# EAGLE design BreakoutBoard (EAGLE 6.4)
AUTHOR: Sandor Szilvasi; AUTHOREMAIL: sandor.szilvasi@vanderbilt.edu; COPYRIGHT: Copyright © 2013 Vanderbilt University, ISIS; PAGE1: Cover Page; PAGE2: General Breakout; PAGE3: Power Board Specific; REVIEWER: Benjamin Babjak; REVIEWEREMAIL: benjamin.babjak@vanderbilt.edu; REVISION: B; TITLE: Smoky

## Sheet 1 of 2
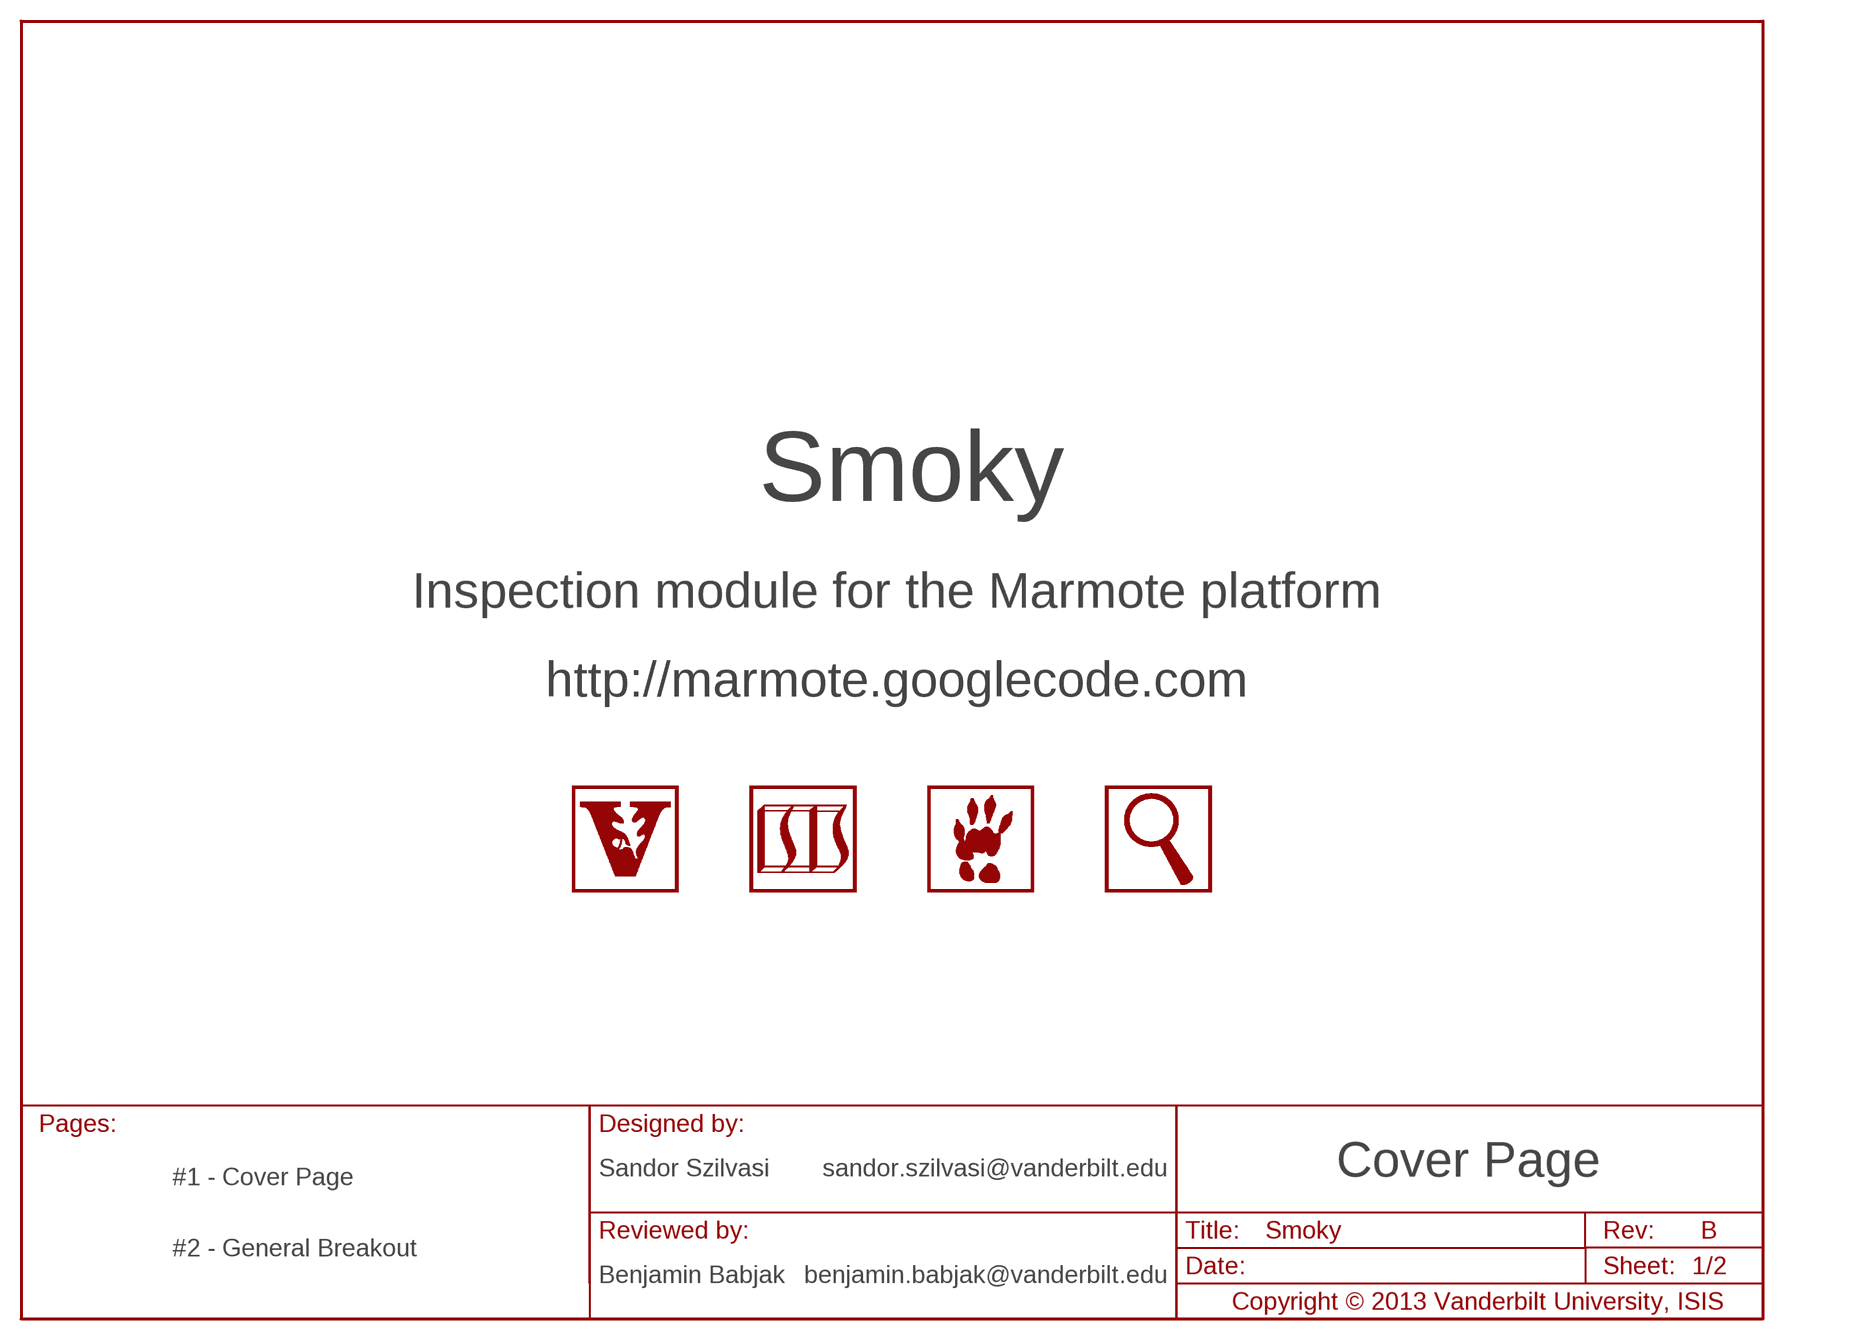
[diagram p0: schematic, sheet 1]

### Parts
LOGO1  LOGO-MAGNIFYING-GLASS-600MIL-10MM-SS  [LOGO-MAGNIFYING-GLASS-10MM-SILKSCREEN]
LOGO5  LOGO-VANDERBILT-600MIL-10MM-SS  [LOGO-VANDERBILT-10MM-SILKSCREEN]
LOGO6  LOGO-ISIS-600MIL-10MM-SS  [LOGO-ISIS-10MM-SILKSCREEN]
LOGO7  LOGO-MARMOTE-600MIL-10MM-SS  [LOGO-MARMOTE-10MM-SILKSCREEN]

### Notes on the sheet
- Inspection module for the Marmote platform
- http://marmote.googlecode.com

## Sheet 2 of 2
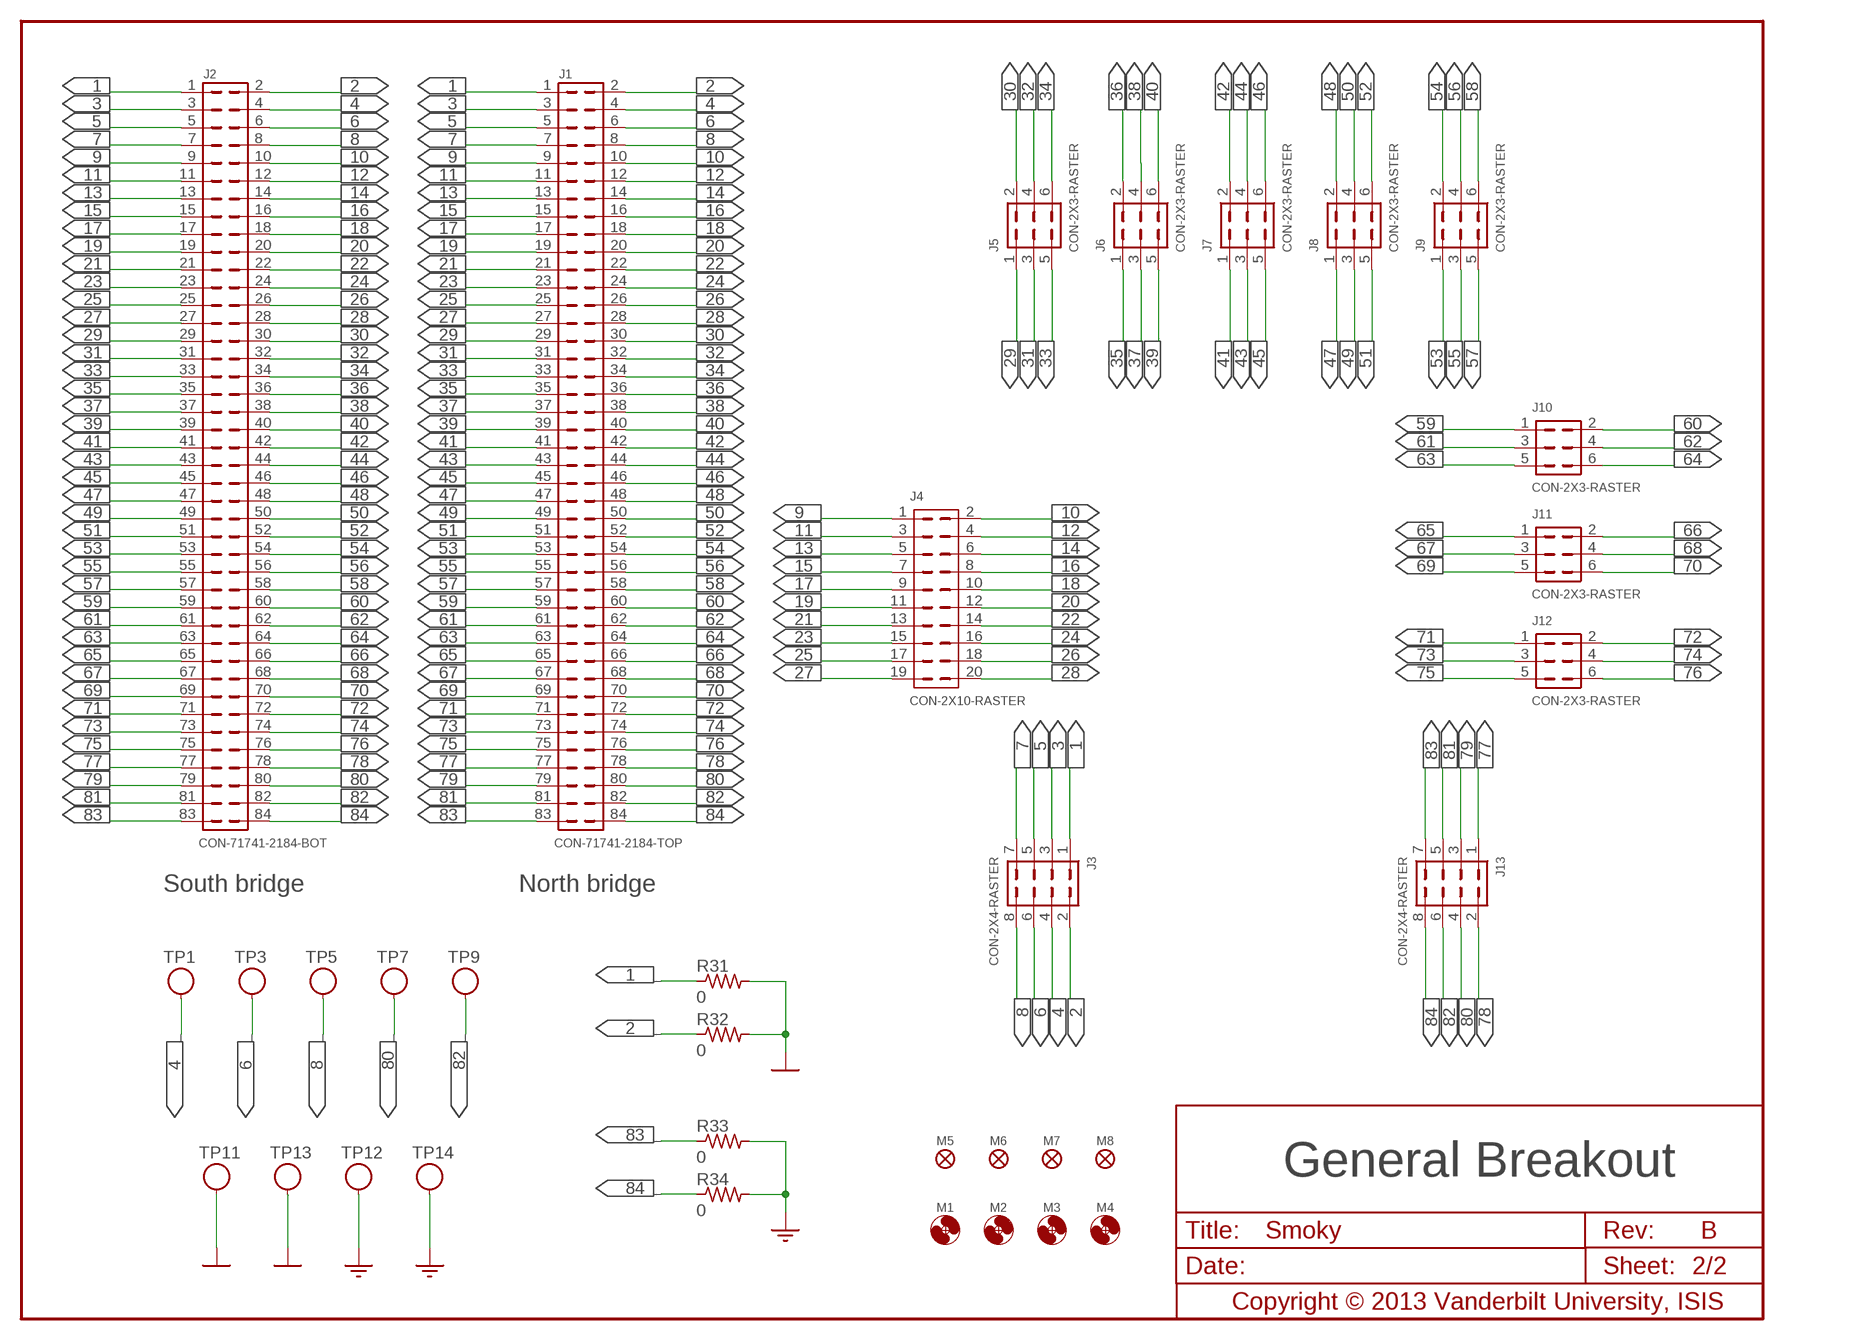
[diagram p1: schematic, sheet 2]

### Parts
J1  CON-71741-2184-TOP  [71741-0002]
J2  CON-71741-2184-BOT  [71742-3003-BOT]
J3  CON-2X4-RASTER  [2X8]
J4  CON-2X10-RASTER  [2X20]
J5  CON-2X3-RASTER  [2X6]
J6  CON-2X3-RASTER  [2X6]
J7  CON-2X3-RASTER  [2X6]
J8  CON-2X3-RASTER  [2X6]
J9  CON-2X3-RASTER  [2X6]
J10  CON-2X3-RASTER  [2X6]
J11  CON-2X3-RASTER  [2X6]
J12  CON-2X3-RASTER  [2X6]
J13  CON-2X4-RASTER  [2X8]
M1  MOUNT-HOLE3.3  [3,3]
M2  MOUNT-HOLE3.3  [3,3]
M3  MOUNT-HOLE3.3  [3,3]
M4  MOUNT-HOLE3.3  [3,3]
M5  FIDUCIAL1X2  [FIDUCIAL-1X2]
M6  FIDUCIAL1X2  [FIDUCIAL-1X2]
M7  FIDUCIAL1X2  [FIDUCIAL-1X2]
M8  FIDUCIAL1X2  [FIDUCIAL-1X2]
R31  0  R0805  [R0805]
R32  0  R0805  [R0805]
R33  0  R0805  [R0805]
R34  0  R0805  [R0805]
TP1  TESTPOINT-BLUE  [TESTPOINT]
TP3  TESTPOINT-BLUE  [TESTPOINT]
TP5  TESTPOINT-BLUE  [TESTPOINT]
TP7  TESTPOINT-GREEN  [TESTPOINT]
TP9  TESTPOINT-GREEN  [TESTPOINT]
TP11  TESTPOINT-YELLOW  [TESTPOINT]
TP12  TESTPOINT-YELLOW  [TESTPOINT]
TP13  TESTPOINT-YELLOW  [TESTPOINT]
TP14  TESTPOINT-YELLOW  [TESTPOINT]

### Nets
1: J1.1 J2.1 J3.1 R31.1
2: J1.2 J2.2 J3.2 R32.1
3: J1.3 J2.3 J3.3
4: J1.4 J2.4 J3.4 TP1.1
5: J1.5 J2.5 J3.5
6: J1.6 J2.6 J3.6 TP3.1
7: J1.7 J2.7 J3.7
8: J1.8 J2.8 J3.8 TP5.1
9: J1.9 J2.9 J4.1
10: J1.10 J2.10 J4.2
11: J1.11 J2.11 J4.3
12: J1.12 J2.12 J4.4
13: J1.13 J2.13 J4.5
14: J1.14 J2.14 J4.6
15: J1.15 J2.15 J4.7
16: J1.16 J2.16 J4.8
17: J1.17 J2.17 J4.9
18: J1.18 J2.18 J4.10
19: J1.19 J2.19 J4.11
20: J1.20 J2.20 J4.12
21: J1.21 J2.21 J4.13
22: J1.22 J2.22 J4.14
23: J1.23 J2.23 J4.15
24: J1.24 J2.24 J4.16
25: J1.25 J2.25 J4.17
26: J1.26 J2.26 J4.18
27: J1.27 J2.27 J4.19
28: J1.28 J2.28 J4.20
29: J1.29 J2.29 J5.1
30: J1.30 J2.30 J5.2
31: J1.31 J2.31 J5.3
32: J1.32 J2.32 J5.4
33: J1.33 J2.33 J5.5
34: J1.34 J2.34 J5.6
35: J1.35 J2.35 J6.1
36: J1.36 J2.36 J6.2
37: J1.37 J2.37 J6.3
38: J1.38 J2.38 J6.4
39: J1.39 J2.39 J6.5
40: J1.40 J2.40 J6.6
41: J1.41 J2.41 J7.1
42: J1.42 J2.42 J7.2
43: J1.43 J2.43 J7.3
44: J1.44 J2.44 J7.4
45: J1.45 J2.45 J7.5
46: J1.46 J2.46 J7.6
47: J1.47 J2.47 J8.1
48: J1.48 J2.48 J8.2
49: J1.49 J2.49 J8.3
50: J1.50 J2.50 J8.4
51: J1.51 J2.51 J8.5
52: J1.52 J2.52 J8.6
53: J1.53 J2.53 J9.1
54: J1.54 J2.54 J9.2
55: J1.55 J2.55 J9.3
56: J1.56 J2.56 J9.4
57: J1.57 J2.57 J9.5
58: J1.58 J2.58 J9.6
59: J1.59 J2.59 J10.1
60: J1.60 J2.60 J10.2
61: J1.61 J2.61 J10.3
62: J1.62 J2.62 J10.4
63: J1.63 J2.63 J10.5
64: J1.64 J2.64 J10.6
65: J1.65 J2.65 J11.1
66: J1.66 J2.66 J11.2
67: J1.67 J2.67 J11.3
68: J1.68 J2.68 J11.4
69: J1.69 J2.69 J11.5
70: J1.70 J2.70 J11.6
71: J1.71 J2.71 J12.1
72: J1.72 J2.72 J12.2
73: J1.73 J2.73 J12.3
74: J1.74 J2.74 J12.4
75: J1.75 J2.75 J12.5
76: J1.76 J2.76 J12.6
77: J1.77 J2.77 J13.1
78: J1.78 J2.78 J13.2
79: J1.79 J2.79 J13.3
80: J1.80 J2.80 J13.4 TP7.1
81: J1.81 J2.81 J13.5
82: J1.82 J2.82 J13.6 TP9.1
83: J1.83 J2.83 J13.7 R33.1
84: J1.84 J2.84 J13.8 R34.1
AGND: R33.2 R34.2 TP12.1 TP14.1
DGND: R31.2 R32.2 TP11.1 TP13.1

### Notes on the sheet
- South bridge | North bridge

## Library data of the parts
J1 = BreakoutBoard:CON-71741: Board-to-Board Connector 1.00mm (.039") Pitch Mezzanine Plug, Surface Mount, Dual Row, Vertical Stacking, 84 Circuits, 8.35mm (.329") Unmated Height, with PCB Locator Pegs, with Robotic Placement Metal Cap, 0.25µm (10µ") Gold (Au) Selective Plating, Embossed Tape on R Source: http://www.molex.com/molex/products/datasheet.jsp?part=active/0717410002_PCB_HEADERS.xml; DIGI-KEY#: WM3498CT-ND; MF: Molex; MPN: 71741-0002
J2 = BreakoutBoard:CON-71741: Board-to-Board Connector 1.00mm (.039") Pitch Mezzanine Plug, Surface Mount, Dual Row, Vertical Stacking, 84 Circuits, 8.35mm (.329") Unmated Height, with PCB Locator Pegs, with Robotic Placement Metal Cap, 0.25µm (10µ") Gold (Au) Selective Plating, Embossed Tape on R Source: http://www.molex.com/molex/products/datasheet.jsp?part=active/0717410002_PCB_HEADERS.xml; DIGI-KEY#: WM3499CT-ND; MF: Molex; MPN: 71742-3003
J3 J13 = BreakoutBoard:CON-2X4-RASTER
J4 = BreakoutBoard:CON-2X10-RASTER
J5-J12 = BreakoutBoard:CON-2X3-RASTER
LOGO1 = Logo:LOGO-MAGNIFYING-GLASS-600MIL: Magnifying Glass Logo Logo for the breakout board of the Marmote platform. Generated from 360 x 360 px bitmap and scaled to 600 x 600 mil. v1.0 Initial design
LOGO5 = Logo:LOGO-VANDERBILT-600MIL: Vanderbilt Logo Official Framed Vanderbilt Logo Generated from 360 x 360 px bitmap and scaled to 600 x 600 mil v1.1 Source bitmap smoothened v1.0 Initial design
LOGO6 = Logo:LOGO-ISIS-600MIL: ISIS Logo Official logo of the Institute for Software Integrated Systems (ISIS), Vanderbilt as of 2011 Generated from 360 x 360 px bitmap and scaled to 600 x 600 mil v1.0 Initial design
LOGO7 = Logo:LOGO-MARMOTE-600MIL: Marmote Platform Logo Preliminary logo for the Marmote Platform (http://marmote.googlecode.com) Generated from 360 x 360 px bitmap and scaled to 600 x 600 mil v1.1 Source bitmap smoothened v1.0 Initial design
M1-M4 = powerboard:MOUNT-HOLE: MOUNTING HOLE with drill center marker
M5-M8 = powerboard:FIDUCIAL: Fiducial Alignment Points Various fiducial points for machine vision alignment.
R31-R34 = BreakoutBoard:R: RESISTOR
TP1 TP3 TP5 = BreakoutBoard:TESTPOINT: Test Point Keystone compact through hole mount test point for SUPPLY and GROUND signals Terminal: .015 (.38) × .032 (.81) thick Phosphor Bronze Wire, Silver Plate Base: Nylon 46, UL Rated 94V-0 Mtg. Hole: .063 (1.6) Diameter Source: http://www.keyelco.com/pdfs/M55p51.pdf; DIGI-KEY#: 5122K-ND; MF: Keystone; MPN: 5122
TP7 TP9 = BreakoutBoard:TESTPOINT: Test Point Keystone compact through hole mount test point for SUPPLY and GROUND signals Terminal: .015 (.38) × .032 (.81) thick Phosphor Bronze Wire, Silver Plate Base: Nylon 46, UL Rated 94V-0 Mtg. Hole: .063 (1.6) Diameter Source: http://www.keyelco.com/pdfs/M55p51.pdf; DIGI-KEY#: 5121K-ND; MF: Keystone; MPN: 5121
TP11-TP14 = BreakoutBoard:TESTPOINT: Test Point Keystone compact through hole mount test point for SUPPLY and GROUND signals Terminal: .015 (.38) × .032 (.81) thick Phosphor Bronze Wire, Silver Plate Base: Nylon 46, UL Rated 94V-0 Mtg. Hole: .063 (1.6) Diameter Source: http://www.keyelco.com/pdfs/M55p51.pdf; DIGI-KEY#: 5009K-ND; MF: Keystone; MPN: 5009

## Board
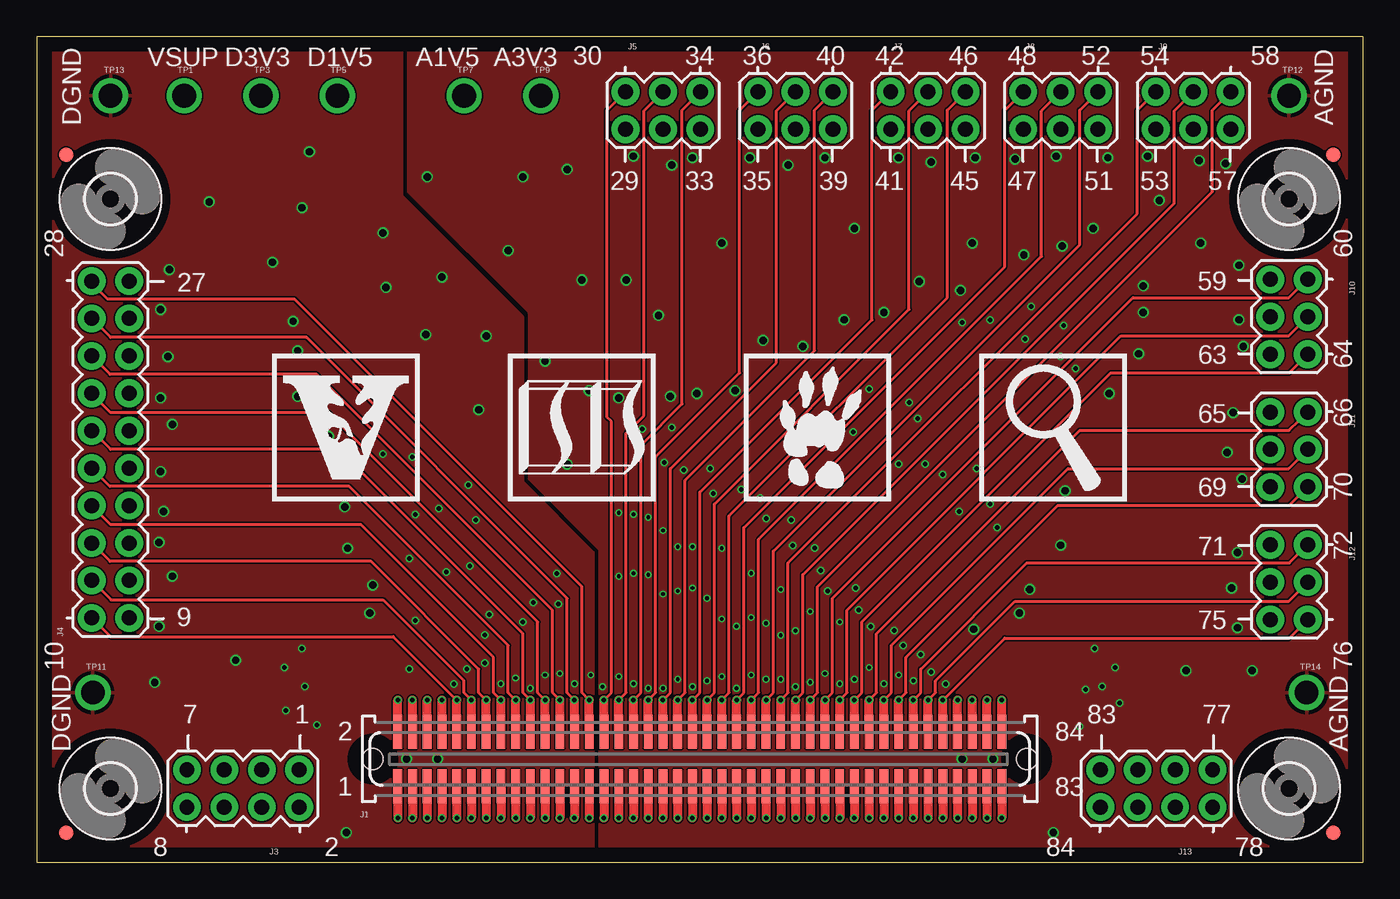
[diagram p2: board, top side]
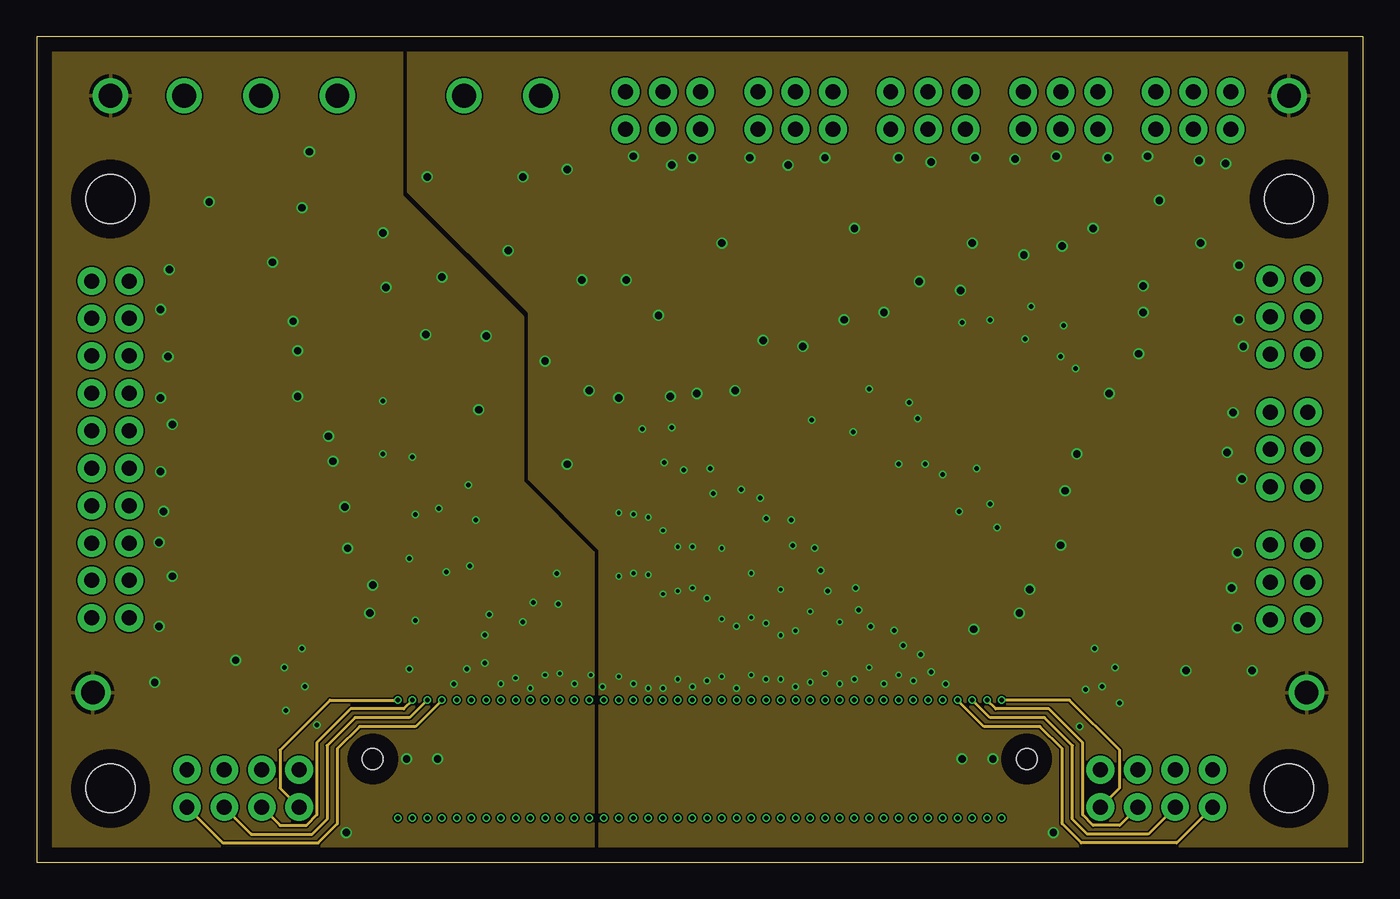
[diagram p3: board, inner layer GND]
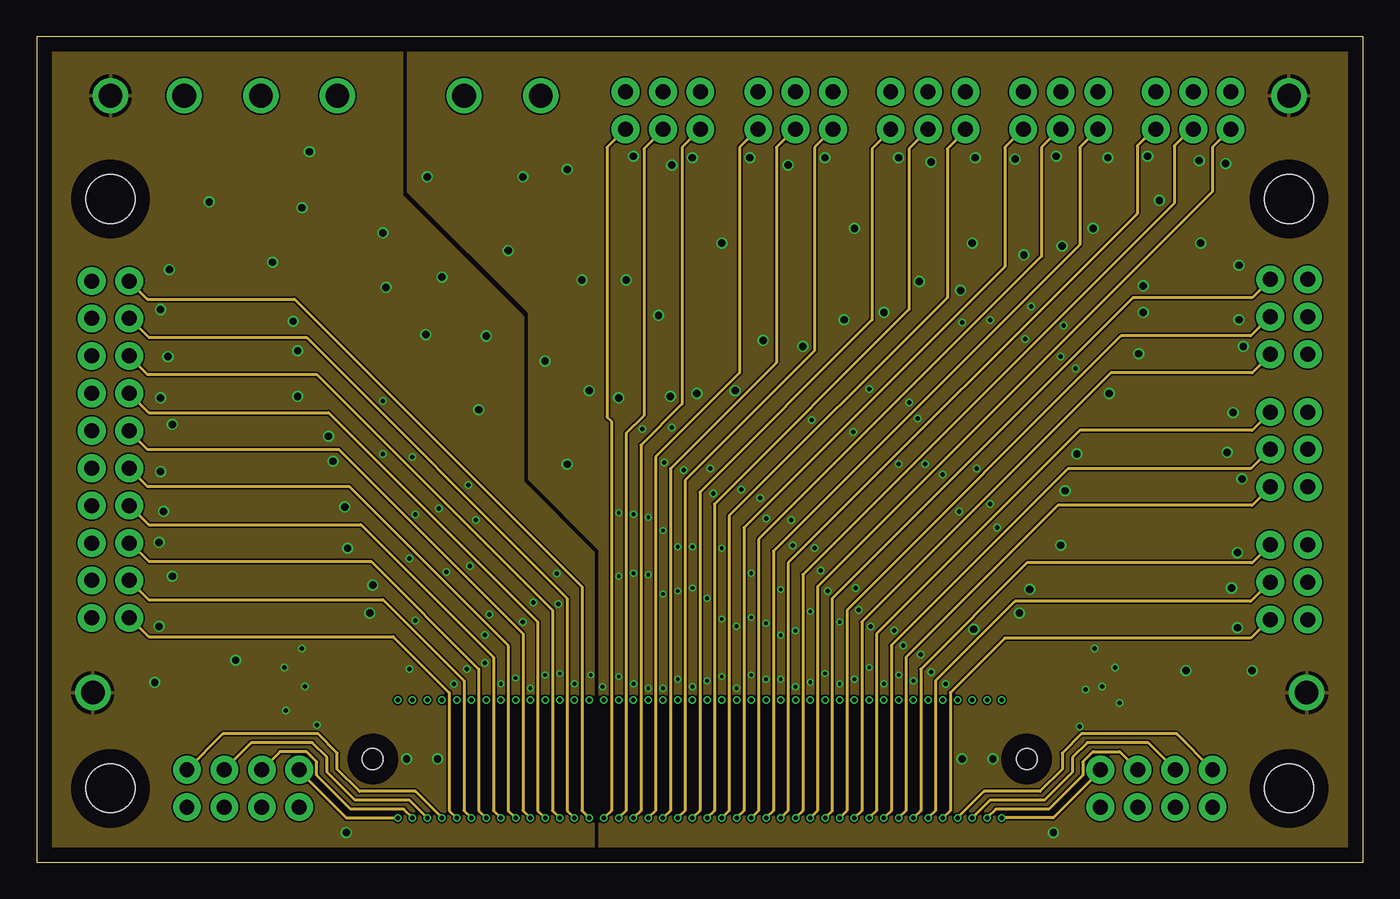
[diagram p4: board, inner layer SIGNAL]
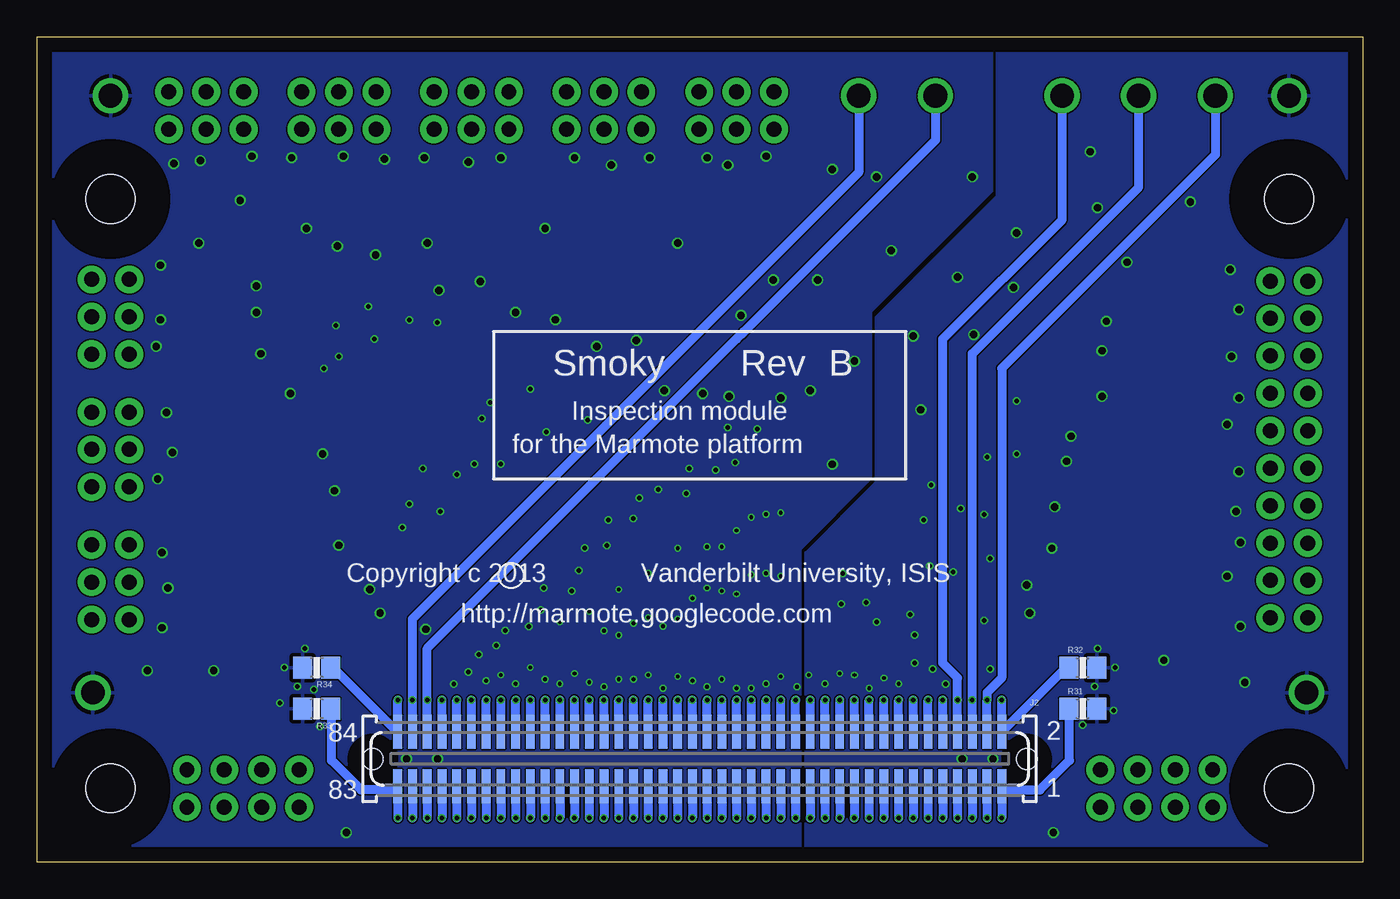
[diagram p5: board, bottom side, seen from below]

Size 90 x 56 mm. Coordinates in mm from the lower left corner, seen from the top.
Outline: 0,56 0,0 90,0 90,56 0,56
Copper layers (1*2+3*16): Top 0.0356mm / dielectric 5mil / GND 0.0356mm / dielectric 5mil / SIGNAL 0.0356mm / dielectric 40mil / Bottom 0.0356mm
Design rules "default": minimum track width 4mil, minimum drill 8mil, track to track 4mil, track to pad 4mil, pad to pad 4mil, via to via 4mil, smd to smd 4mil, copper to edge 40mil, drill to drill 8mil, minimum pad ring 10mil, minimum via ring 4mil, stop-mask expansion 2mil, vias tented up to drill 0.5mm, thermal gap 10mil

### Footprints (pad centres in the part's own frame; a part is rotated, then mirrored left to right if it is on the bottom)
71741-0002 = smd 0.6 x 2.3: 1 -20.5,-1.85; 2 -20.5,1.85; 3 -19.5,-1.85; 4 -19.5,1.85; 5 -18.5,-1.85; 6 -18.5,1.85; 7 -17.5,-1.85; 8 -17.5,1.85; 9 -16.5,-1.85; 10 -16.5,1.85; 11 -15.5,-1.85; 12 -15.5,1.85; 13 -14.5,-1.85; 14 -14.5,1.85; 15 -13.5,-1.85; 16 -13.5,1.85; 17 -12.5,-1.85; 18 -12.5,1.85; 19 -11.5,-1.85; 20 -11.5,1.85; 21 -10.5,-1.85; 22 -10.5,1.85; 23 -9.5,-1.85; 24 -9.5,1.85; 25 -8.5,-1.85; 26 -8.5,1.85; 27 -7.5,-1.85; 28 -7.5,1.85; 29 -6.5,-1.85; 30 -6.5,1.85; 31 -5.5,-1.85; 32 -5.5,1.85; 33 -4.5,-1.85; 34 -4.5,1.85; 35 -3.5,-1.85; 36 -3.5,1.85; 37 -2.5,-1.85; 38 -2.5,1.85; 39 -1.5,-1.85; 40 -1.5,1.85; 41 -0.5,-1.85; 42 -0.5,1.85; 43 0.5,-1.85; 44 0.5,1.85; 45 1.5,-1.85; 46 1.5,1.85; 47 2.5,-1.85; 48 2.5,1.85; 49 3.5,-1.85; 50 3.5,1.85; 51 4.5,-1.85; 52 4.5,1.85; 53 5.5,-1.85; 54 5.5,1.85; 55 6.5,-1.85; 56 6.5,1.85; 57 7.5,-1.85; 58 7.5,1.85; 59 8.5,-1.85; 60 8.5,1.85; 61 9.5,-1.85; 62 9.5,1.85; 63 10.5,-1.85; 64 10.5,1.85; 65 11.5,-1.85; 66 11.5,1.85; 67 12.5,-1.85; 68 12.5,1.85; 69 13.5,-1.85; 70 13.5,1.85; 71 14.5,-1.85; 72 14.5,1.85; 73 15.5,-1.85; 74 15.5,1.85; 75 16.5,-1.85; 76 16.5,1.85; 77 17.5,-1.85; 78 17.5,1.85; 79 18.5,-1.85; 80 18.5,1.85; 81 19.5,-1.85; 82 19.5,1.85; 83 20.5,-1.85; 84 20.5,1.85 | hole 1.4: -22.2,0; 22.2,0
71742-3003-BOT = smd 0.6 x 2.3: 1 -20.5,1.85; 2 -20.5,-1.85; 3 -19.5,1.85; 4 -19.5,-1.85; 5 -18.5,1.85; 6 -18.5,-1.85; 7 -17.5,1.85; 8 -17.5,-1.85; 9 -16.5,1.85; 10 -16.5,-1.85; 11 -15.5,1.85; 12 -15.5,-1.85; 13 -14.5,1.85; 14 -14.5,-1.85; 15 -13.5,1.85; 16 -13.5,-1.85; 17 -12.5,1.85; 18 -12.5,-1.85; 19 -11.5,1.85; 20 -11.5,-1.85; 21 -10.5,1.85; 22 -10.5,-1.85; 23 -9.5,1.85; 24 -9.5,-1.85; 25 -8.5,1.85; 26 -8.5,-1.85; 27 -7.5,1.85; 28 -7.5,-1.85; 29 -6.5,1.85; 30 -6.5,-1.85; 31 -5.5,1.85; 32 -5.5,-1.85; 33 -4.5,1.85; 34 -4.5,-1.85; 35 -3.5,1.85; 36 -3.5,-1.85; 37 -2.5,1.85; 38 -2.5,-1.85; 39 -1.5,1.85; 40 -1.5,-1.85; 41 -0.5,1.85; 42 -0.5,-1.85; 43 0.5,1.85; 44 0.5,-1.85; 45 1.5,1.85; 46 1.5,-1.85; 47 2.5,1.85; 48 2.5,-1.85; 49 3.5,1.85; 50 3.5,-1.85; 51 4.5,1.85; 52 4.5,-1.85; 53 5.5,1.85; 54 5.5,-1.85; 55 6.5,1.85; 56 6.5,-1.85; 57 7.5,1.85; 58 7.5,-1.85; 59 8.5,1.85; 60 8.5,-1.85; 61 9.5,1.85; 62 9.5,-1.85; 63 10.5,1.85; 64 10.5,-1.85; 65 11.5,1.85; 66 11.5,-1.85; 67 12.5,1.85; 68 12.5,-1.85; 69 13.5,1.85; 70 13.5,-1.85; 71 14.5,1.85; 72 14.5,-1.85; 73 15.5,1.85; 74 15.5,-1.85; 75 16.5,1.85; 76 16.5,-1.85; 77 17.5,1.85; 78 17.5,-1.85; 79 18.5,1.85; 80 18.5,-1.85; 81 19.5,1.85; 82 19.5,-1.85; 83 20.5,1.85; 84 20.5,-1.85 | hole 1.4: -22.2,0; 22.2,0
2X8 = drill 1.016 pad 1.88: 1 -3.81,-1.27; 2 -3.81,1.27; 3 -1.27,-1.27; 4 -1.27,1.27; 5 1.27,-1.27; 6 1.27,1.27; 7 3.81,-1.27; 8 3.81,1.27
2X20 = drill 1.016 pad 1.88: 1 -11.43,-1.27; 2 -11.43,1.27; 3 -8.89,-1.27; 4 -8.89,1.27; 5 -6.35,-1.27; 6 -6.35,1.27; 7 -3.81,-1.27; 8 -3.81,1.27; 9 -1.27,-1.27; 10 -1.27,1.27; 11 1.27,-1.27; 12 1.27,1.27; 13 3.81,-1.27; 14 3.81,1.27; 15 6.35,-1.27; 16 6.35,1.27; 17 8.89,-1.27; 18 8.89,1.27; 19 11.43,-1.27; 20 11.43,1.27
2X6 = drill 1.016 pad 1.88: 1 -2.54,-1.27; 2 -2.54,1.27; 3 0,-1.27; 4 0,1.27; 5 2.54,-1.27; 6 2.54,1.27
3,3 = hole 3.3: 0,0
FIDUCIAL-1X2 = smd 1 x 1: 1 0,0
R0805 = smd 1.3 x 1.5: 1 -0.95,0; 2 0.95,0
TESTPOINT = drill 1.6: 1 0,0

### Placement (x,y rotation side)
J1  45,7 0 top
J2  45,7 180 bottom
J3  14,5 180 top
J4  5,28 90 top
J5  42.5,51 0 top
J6  51.5,51 0 top
J7  60.5,51 0 top
J8  69.5,51 0 top
J9  78.5,51 0 top
J10  85,37 270 top
J11  85,28 270 top
J12  85,19 270 top
J13  76,5 180 top
LOGO1  64,24.5 0 top
LOGO5  16,24.5 0 top
LOGO6  32,24.5 0 top
LOGO7  48,24.5 0 top
M1  5,5 0 top
M2  5,45 0 top
M3  85,45 0 top
M4  85,5 0 top
M5  2,2 0 top
M6  2,48 0 top
M7  88,48 0 top
M8  88,2 0 top
R31  19,10.4 0 bottom
R32  19,13.2 0 bottom
R33  71,10.4 180 bottom
R34  71,13.2 180 bottom
TP1  10,52 0 top
TP3  15.2,52 0 top
TP5  20.4,52 0 top
TP7  29,52 0 top
TP9  34.2,52 0 top
TP11  3.8,11.5 0 top
TP12  85,52 0 top
TP13  5,52 0 top
TP14  86.2,11.5 0 top

### Tracks (layer width: path | path; a pad name or v marks a point on that pad's centre or on a via)
1  (via drill 0.3)
  Top 0.61: J1.1 v24.5,3
  SIGNAL 0.203: 18,6 21,3 v24.5,3
  SIGNAL 0.254: 18,6 17.81,6 J3.1
  Bottom 0.254: 19.9,9.8 19.95,9.8 R31.1 | 24.45,5.13 24.5,5.13 J1.1
  Bottom 0.406: 24.45,5.13 24.4,4.9
  Bottom 0.61: 24.4,4.9 21.9,4.9 19.9,6.9 19.9,9.8 | J1.1 v24.5,3
2  (via drill 0.3)
  Top 0.61: J1.2 v24.5,11
  GND 0.203: v24.5,11 19.9,11 16.5,7.6 16.5,5.02 J3.2
  Bottom 0.254: 20.35,13 19.95,13 R32.1
  Bottom 0.61: 20.35,13 J1.2 v24.5,11
3  (via drill 0.3)
  Top 0.61: J1.3 v25.5,3
  SIGNAL 0.203: v25.5,3 24.9,3.6 21.3,3.6 19,5.9 19,6.8 18.3,7.5 16.5,7.5 J3.3
  Bottom 0.61: J1.3 v25.5,3
4  (via drill 0.3)
  Top 0.61: J1.4 v25.5,11
  GND 0.203: v25.5,11 24.9,10.4 21.3,10.4 19,8.1 19,3.2 18.3,2.5 16.5,2.5 J3.4
  Bottom 0.61: J1.4 v25.5,11 25.5,11.5 24.5,12.5 24.5,33.5 10,48 TP1.1
5  (via drill 0.3)
  Top 0.61: J1.5 v26.5,3
  SIGNAL 0.203: v26.5,3 25.3,4.2 21.6,4.2 19.7,6.1 19.7,7.1 18.7,8.1 14.56,8.1 J3.5
  Bottom 0.61: J1.5 v26.5,3
6  (via drill 0.3)
  Top 0.61: J1.6 v26.5,11
  GND 0.203: v26.5,11 25.3,9.8 21.6,9.8 19.7,7.9 19.7,2.9 18.7,1.9 14.56,1.9 J3.6
  Bottom 0.61: J1.6 v26.5,11 26.5,34.5 15.2,45.8 TP3.1
7  (via drill 0.3)
  Top 0.61: J1.7 v27.5,3
  SIGNAL 0.203: v27.5,3 25.7,4.8 21.9,4.8 20.4,6.3 20.4,7.4 19.1,8.7 12.62,8.7 J3.7
  Bottom 0.61: J1.7 v27.5,3
8  (via drill 0.3)
  Top 0.61: J1.8 v27.5,11
  GND 0.203: v27.5,11 25.7,9.2 21.9,9.2 20.4,7.7 20.4,2.6 19.1,1.3 12.62,1.3 J3.8
  Bottom 0.61: J1.8 v27.5,11 27.5,12.5 28.5,13.5 28.5,35.5 20.4,43.6 TP5.1
9  (via drill 0.3)
  Top 0.61: J1.9 v28.5,3
  SIGNAL 0.203: v28.5,3 28,3.5 28,11.5 24.2,15.3 7.6,15.3 6.33,16.57 J4.1
  Bottom 0.61: J1.9 v28.5,3
10  (via drill 0.3)
  Top 0.203: J4.2 5,15.3 24.2,15.3 v28.5,11
  Top 0.61: J1.10 v28.5,11
  Bottom 0.61: J1.10 v28.5,11
11  (via drill 0.3)
  Top 0.61: J1.11 v29.5,3
  SIGNAL 0.203: v29.5,3 29,3.5 29,12.3 23.49,17.81 7.6,17.8 6.29,19.11 J4.3
  Bottom 0.61: J1.11 v29.5,3
12  (via drill 0.3)
  Top 0.203: J4.4 5.04,17.8 23.5,17.8 29,12.3 29,11.5 v29.5,11
  Top 0.61: J1.12 v29.5,11
  Bottom 0.61: J1.12 v29.5,11
13  (via drill 0.3)
  Top 0.61: J1.13 v30.5,3
  SIGNAL 0.203: v30.5,3 30,3.5 30,13.1 22.7,20.4 7.6,20.4 6.35,21.65 J4.5
  Bottom 0.61: J1.13 v30.5,3
14  (via drill 0.3)
  Top 0.203: J4.6 4.98,20.4 22.7,20.4 30,13.1 30,11.5 v30.5,11
  Top 0.61: J1.14 v30.5,11
  Bottom 0.61: J1.14 v30.5,11
15  (via drill 0.3)
  Top 0.61: J1.15 v31.5,3
  SIGNAL 0.203: v31.5,3 31,3.5 31,13.9 22,22.9 7.6,22.9 6.31,24.19 J4.7
  Bottom 0.61: J1.15 v31.5,3
16  (via drill 0.3)
  Top 0.203: J4.8 5.02,22.9 22,22.9 31,13.9 31,11.5 v31.5,11
  Top 0.61: J1.16 v31.5,11
  Bottom 0.61: J1.16 v31.5,11
17  (via drill 0.3)
  Top 0.61: J1.17 v32.5,3
  SIGNAL 0.203: v32.5,3 32,3.5 32,14.7 21.2,25.5 7.5,25.5 J4.9
  Bottom 0.61: J1.17 v32.5,3
18  (via drill 0.3)
  Top 0.203: J4.10 4.96,25.5 21.2,25.5 32,14.7 32,11.5 v32.5,11
  Top 0.61: J1.18 v32.5,11
  Bottom 0.61: J1.18 v32.5,11
19  (via drill 0.3)
  Top 0.61: J1.19 v33.5,3
  SIGNAL 0.203: v33.5,3 33,3.5 33,15.5 20.5,28 7.5,28 6.27,29.23 J4.11
  Bottom 0.61: J1.19 v33.5,3
20  (via drill 0.3)
  Top 0.203: J4.12 5,28 20.5,28 33,15.5 33,11.5 v33.5,11
  Top 0.61: J1.20 v33.5,11
  Bottom 0.61: J1.20 v33.5,11
21  (via drill 0.3)
  Top 0.61: J1.21 v34.5,3
  SIGNAL 0.203: v34.5,3 34,3.5 34,16.3 19.8,30.5 7.6,30.5 6.29,31.81 J4.13
  Bottom 0.61: J1.21 v34.5,3
22  (via drill 0.3)
  Top 0.203: J4.14 5,30.5 19.8,30.5 34,16.3 34,11.5 v34.5,11
  Top 0.61: J1.22 v34.5,11
  Bottom 0.61: J1.22 v34.5,11
23  (via drill 0.3)
  Top 0.61: J1.23 v35.5,3
  SIGNAL 0.203: v35.5,3 35,3.5 35,17.1 19,33.1 7.5,33.1 6.27,34.33 J4.15
  Bottom 0.61: J1.23 v35.5,3
24  (via drill 0.3)
  Top 0.203: J4.16 4.98,33.1 19,33.1 35,17.1 35,11.5 v35.5,11
  Top 0.61: J1.24 v35.5,11
  Bottom 0.61: J1.24 v35.5,11
25  (via drill 0.3)
  Top 0.61: J1.25 v36.5,3
  SIGNAL 0.203: v36.5,3 36,3.5 36,17.9 18.3,35.6 7.6,35.6 6.31,36.89 J4.17
  Bottom 0.61: J1.25 v36.5,3
26  (via drill 0.3)
  Top 0.203: J4.18 5,35.6 18.3,35.6 36,17.9 36,11.5 v36.5,11
  Top 0.61: J1.26 v36.5,11
  Bottom 0.61: J1.26 v36.5,11
27  (via drill 0.3)
  Top 0.61: J1.27 v37.5,3
  SIGNAL 0.203: v37.5,3 37,3.5 37,18.7 17.5,38.2 7.5,38.2 J4.19
  Bottom 0.61: J1.27 v37.5,3
28  (via drill 0.3)
  Top 0.203: 3.73,39.27 4.8,38.2 17.5,38.2 37,18.7 37,11.5 v37.5,11
  Top 0.254: 3.73,39.27 J4.20
  Top 0.61: J1.28 v37.5,11
  Bottom 0.61: J1.28 v37.5,11
29  (via drill 0.3)
  Top 0.61: J1.29 v38.5,3
  SIGNAL 0.203: v38.5,3 39,3.5 39,29.9 38.7,30.2 38.7,48.5 39.93,49.73 J5.1
  Bottom 0.61: J1.29 v38.5,3
30  (via drill 0.3)
  Top 0.203: J5.2 38.7,51.01 38.7,30.2 39,29.9 39,11.9 39,11.5 v38.5,11
  Top 0.61: J1.30 v38.5,11
  Bottom 0.61: J1.30 v38.5,11
31  (via drill 0.3)
  Top 0.61: J1.31 v39.5,3
  SIGNAL 0.203: v39.5,3 40,3.5 40,29.1 41.2,30.3 41.2,48.4 42.5,49.7 J5.3
  Bottom 0.61: J1.31 v39.5,3
32  (via drill 0.3)
  Top 0.203: J5.4 41.2,50.97 41.2,30.3 40,29.1 40,11.5 v39.5,11
  Top 0.61: J1.32 v39.5,11
  Bottom 0.61: J1.32 v39.5,11
33  (via drill 0.3)
  Top 0.61: J1.33 v40.5,3
  SIGNAL 0.203: v40.5,3 41,3.5 41,28.3 43.8,31.1 43.8,48.5 J5.5
  Bottom 0.61: J1.33 v40.5,3
34  (via drill 0.3)
  Top 0.203: J5.6 43.8,51.03 43.8,31.1 41,28.3 41,11.5 v40.5,11
  Top 0.61: J1.34 v40.5,11
  Bottom 0.61: J1.34 v40.5,11
35  (via drill 0.3)
  Top 0.61: J1.35 v41.5,3
  SIGNAL 0.203: v41.5,3 42,3.5 42,27.5 47.7,33.2 47.7,48.5 48.93,49.73 J6.1
  Bottom 0.61: J1.35 v41.5,3
36  (via drill 0.3)
  Top 0.203: J6.2 47.7,51.01 47.7,33.2 42,27.5 42,11.5 v41.5,11
  Top 0.61: J1.36 v41.5,11
  Bottom 0.61: J1.36 v41.5,11
37  (via drill 0.3)
  Top 0.61: J1.37 v42.5,3
  SIGNAL 0.203: v42.5,3 43,3.5 43,26.7 50.2,33.9 50.2,48.5 51.43,49.73 J6.3
  Bottom 0.61: J1.37 v42.5,3
38  (via drill 0.3)
  Top 0.203: J6.4 50.2,50.97 50.2,33.9 43,26.7 43,11.5 v42.5,11
  Top 0.61: J1.38 v42.5,11
  Bottom 0.61: J1.38 v42.5,11
39  (via drill 0.3)
  Top 0.61: J1.39 v43.5,3
  SIGNAL 0.203: v43.5,3 44,3.5 44,25.9 52.8,34.7 52.8,48.5 J6.5
  Bottom 0.61: J1.39 v43.5,3
40  (via drill 0.3)
  Top 0.203: J6.6 52.8,51.03 52.8,34.7 44,25.9 44,11.5 v43.5,11
  Top 0.61: J1.40 v43.5,11
  Bottom 0.61: J1.40 v43.5,11
41  (via drill 0.3)
  Top 0.61: J1.41 v44.5,3
  SIGNAL 0.203: v44.5,3 45,3.5 45,25.1 56.7,36.8 56.7,48.4 57.96,49.66 J7.1
  Bottom 0.61: J1.41 v44.5,3
42  (via drill 0.3)
  Top 0.203: J7.2 56.7,51.01 56.7,36.8 45,25.1 45,11.5 v44.5,11
  Top 0.61: J1.42 v44.5,11
  Bottom 0.61: J1.42 v44.5,11
43  (via drill 0.3)
  Top 0.61: J1.43 v45.5,3
  SIGNAL 0.203: v45.5,3 46,3.5 46,24.3 59.2,37.5 59.2,48.4 60.5,49.7 J7.3
  Bottom 0.61: J1.43 v45.5,3
44  (via drill 0.3)
  Top 0.203: J7.4 59.2,50.97 59.2,37.5 46,24.3 46,11.5 v45.5,11
  Top 0.61: J1.44 v45.5,11
  Bottom 0.61: J1.44 v45.5,11
45  (via drill 0.3)
  Top 0.61: J1.45 v46.5,3
  SIGNAL 0.203: v46.5,3 47,3.5 47,23.5 61.8,38.3 61.8,48.4 63.04,49.64 J7.5
  Bottom 0.61: J1.45 v46.5,3
46  (via drill 0.3)
  Top 0.203: J7.6 61.8,51.03 61.8,38.3 47,23.5 47,11.5 v46.5,11
  Top 0.61: J1.46 v46.5,11
  Bottom 0.61: J1.46 v46.5,11
47  (via drill 0.3)
  Top 0.61: J1.47 v47.5,3
  SIGNAL 0.203: v47.5,3 48,3.5 48,22.7 65.7,40.4 65.7,48.5 66.93,49.73 J8.1
  Bottom 0.61: J1.47 v47.5,3
48  (via drill 0.3)
  Top 0.203: J8.2 65.7,51.01 65.7,40.4 48,22.7 48,11.5 v47.5,11
  Top 0.61: J1.48 v47.5,11
  Bottom 0.61: J1.48 v47.5,11
49  (via drill 0.3)
  Top 0.61: J1.49 v48.5,3
  SIGNAL 0.203: v48.5,3 49,3.5 49,21.9 68.2,41.1 68.2,48.5 69.43,49.73 J8.3
  Bottom 0.61: J1.49 v48.5,3
50  (via drill 0.3)
  Top 0.203: J8.4 68.2,50.97 68.2,41.1 49,21.9 49,11.5 v48.5,11
  Top 0.61: J1.50 v48.5,11
  Bottom 0.61: J1.50 v48.5,11
51  (via drill 0.3)
  Top 0.61: J1.51 v49.5,3
  SIGNAL 0.203: v49.5,3 50,3.5 50,21.1 70.8,41.9 70.8,48.5 J8.5
  Bottom 0.61: J1.51 v49.5,3
52  (via drill 0.3)
  Top 0.203: J8.6 70.8,51.03 70.8,41.9 50,21.1 50,11.5 v49.5,11
  Top 0.61: J1.52 v49.5,11
  Bottom 0.61: J1.52 v49.5,11
53  (via drill 0.3)
  Top 0.61: J1.53 v50.5,3
  SIGNAL 0.203: v50.5,3 51,3.5 51,20.3 74.7,44 74.7,48.6 75.83,49.73 J9.1
  Bottom 0.61: J1.53 v50.5,3
54  (via drill 0.3)
  Top 0.203: J9.2 74.7,51.01 74.7,44 51,20.3 51,11.5 v50.5,11
  Top 0.61: J1.54 v50.5,11
  Bottom 0.61: J1.54 v50.5,11
55  (via drill 0.3)
  Top 0.61: J1.55 v51.5,3
  SIGNAL 0.203: v51.5,3 52,3.5 52,19.5 77.2,44.7 77.2,48.6 78.33,49.73 J9.3
  Bottom 0.61: J1.55 v51.5,3
56  (via drill 0.3)
  Top 0.203: J9.4 77.2,50.97 77.2,44.7 52,19.5 52,11.5 v51.5,11
  Top 0.61: J1.56 v51.5,11
  Bottom 0.61: J1.56 v51.5,11
57  (via drill 0.3)
  Top 0.61: J1.57 v52.5,3
  SIGNAL 0.203: v52.5,3 53,3.5 53,18.7 79.8,45.5 79.8,48.5 81,49.7
  SIGNAL 0.254: 81,49.7 81.04,49.7 J9.5
  Bottom 0.61: J1.57 v52.5,3
58  (via drill 0.3)
  Top 0.203: J9.6 79.8,51.03 79.8,45.5 53,18.7 53,11.5 v52.5,11
  Top 0.61: J1.58 v52.5,11
  Bottom 0.61: J1.58 v52.5,11
59  (via drill 0.3)
  Top 0.61: J1.59 v53.5,3
  SIGNAL 0.203: v53.5,3 54,3.5 54,17.9 74.4,38.3 82.5,38.3 J10.1
  Bottom 0.61: J1.59 v53.5,3
60  (via drill 0.3)
  Top 0.203: J10.2 85,38.3 74.4,38.3 54,17.9 54,11.5 v53.5,11
  Top 0.61: J1.60 v53.5,11
  Bottom 0.61: J1.60 v53.5,11
61  (via drill 0.3)
  Top 0.61: J1.61 v54.5,3
  SIGNAL 0.203: v54.5,3 55,3.5 55,17.1 73.6,35.7 82.4,35.7 83.7,37 J10.3
  Bottom 0.61: J1.61 v54.5,3
62  (via drill 0.3)
  Top 0.203: J10.4 84.97,35.7 73.6,35.7 55,17.1 55,11.5 v54.5,11
  Top 0.61: J1.62 v54.5,11
  Bottom 0.61: J1.62 v54.5,11
63  (via drill 0.3)
  Top 0.61: J1.63 v55.5,3
  SIGNAL 0.203: v55.5,3 56,3.5 56,16.3 72.9,33.2 82.5,33.2 83.73,34.43 J10.5
  Bottom 0.61: J1.63 v55.5,3
64  (via drill 0.3)
  Top 0.203: J10.6 85.01,33.2 72.9,33.2 56,16.3 56,11.5 v55.5,11
  Top 0.61: J1.64 v55.5,11
  Bottom 0.61: J1.64 v55.5,11
65  (via drill 0.3)
  Top 0.61: J1.65 v56.5,3
  SIGNAL 0.203: v56.5,3 57,3.5 57,15.5 70.8,29.3 82.5,29.3 J11.1
  Bottom 0.61: J1.65 v56.5,3
66  (via drill 0.3)
  Top 0.203: J11.2 85,29.3 70.8,29.3 57,15.5 57,11.5 v56.5,11
  Top 0.61: J1.66 v56.5,11
  Bottom 0.61: J1.66 v56.5,11
67  (via drill 0.3)
  Top 0.61: J1.67 v57.5,3
  SIGNAL 0.203: v57.5,3 58,3.5 58,14.7 70,26.7 82.4,26.7 83.7,28 J11.3
  Bottom 0.61: J1.67 v57.5,3
68  (via drill 0.3)
  Top 0.203: J11.4 84.97,26.7 70,26.7 58,14.7 58,11.5 v57.5,11
  Top 0.61: J1.68 v57.5,11
  Bottom 0.61: J1.68 v57.5,11
69  (via drill 0.3)
  Top 0.61: J1.69 v58.5,3
  SIGNAL 0.203: v58.5,3 59,3.5 59,13.9 69.3,24.2 82.5,24.2 83.73,25.43 J11.5
  Bottom 0.61: J1.69 v58.5,3
70  (via drill 0.3)
  Top 0.203: J11.6 85.01,24.2 69.3,24.2 59,13.9 59,11.5 v58.5,11
  Top 0.61: J1.70 v58.5,11
  Bottom 0.61: J1.70 v58.5,11
71  (via drill 0.3)
  Top 0.61: J1.71 v59.5,3
  SIGNAL 0.203: v59.5,3 60,3.5 60,13.1 67.2,20.3 82.5,20.3 J12.1
  Bottom 0.61: J1.71 v59.5,3
72  (via drill 0.3)
  Top 0.203: J12.2 85.03,20.3 67.2,20.3 60,13.1 60,11.5 v59.5,11
  Top 0.61: J1.72 v59.5,11
  Bottom 0.61: J1.72 v59.5,11
73  (via drill 0.3)
  Top 0.61: J1.73 v60.5,3
  SIGNAL 0.203: v60.5,3 61,3.5 61,12.3 66.4,17.7 82.4,17.7 83.7,19 J12.3
  Bottom 0.61: J1.73 v60.5,3
74  (via drill 0.3)
  Top 0.203: J12.4 84.97,17.7 66.4,17.7 61,12.3 61,11.5 v60.5,11
  Top 0.61: J1.74 v60.5,11
  Bottom 0.61: J1.74 v60.5,11
75  (via drill 0.3)
  Top 0.61: J1.75 v61.5,3
  SIGNAL 0.203: v61.5,3 62,3.5 62,11.5 65.7,15.2 82.4,15.2 83.66,16.46
  SIGNAL 0.254: 83.66,16.46 J12.5
  Bottom 0.61: J1.75 v61.5,3
76  (via drill 0.3)
  Top 0.203: J12.6 85.01,15.2 65.7,15.2 v61.5,11
  Top 0.61: J1.76 v61.5,11
  Bottom 0.61: J1.76 v61.5,11
77  (via drill 0.3)
  Top 0.61: J1.77 v62.5,3
  SIGNAL 0.203: J13.1 77.38,8.7 70.9,8.7 69.6,7.4 69.6,6.3 68.1,4.8 64.3,4.8 v62.5,3
  Bottom 0.61: J1.77 v62.5,3
78  (via drill 0.3)
  Top 0.61: J1.78 v62.5,11
  GND 0.203: J13.2 77.38,1.3 70.9,1.3 69.6,2.6 69.6,7.7 68.1,9.2 64.3,9.2 v62.5,11
  Bottom 0.61: J1.78 v62.5,11
79  (via drill 0.3)
  Top 0.61: J1.79 v63.5,3
  SIGNAL 0.203: J13.3 75.44,8.1 71.3,8.1 70.3,7.1 70.3,6.1 68.4,4.2 64.7,4.2 v63.5,3
  Bottom 0.61: J1.79 v63.5,3
80  (via drill 0.3)
  Top 0.61: J1.80 v63.5,11
  GND 0.203: J13.4 75.44,1.9 71.3,1.9 70.3,2.9 70.3,7.9 68.4,9.8 64.7,9.8 v63.5,11
  Bottom 0.61: J1.80 v63.5,11 63.5,14.5 42.5,35.5 42,36 29,49 TP7.1
81  (via drill 0.3)
  Top 0.61: J1.81 v64.5,3
  SIGNAL 0.203: J13.5 73.5,7.5 71.7,7.5 71,6.8 71,5.9 68.7,3.6 65.1,3.6 v64.5,3
  Bottom 0.61: J1.81 v64.5,3
82  (via drill 0.3)
  Top 0.61: J1.82 v64.5,11
  GND 0.203: J13.6 73.5,2.5 71.7,2.5 71,3.2 71,8.1 68.7,10.4 65.1,10.4 v64.5,11
  Bottom 0.61: J1.82 v64.5,11 64.5,16.5 39,42 38,43 34.2,46.8 TP9.1
83  (via drill 0.3)
  Top 0.61: J1.83 v65.5,3
  SIGNAL 0.203: v65.5,3 69,3 72,6
  SIGNAL 0.254: 72,6 72.19,6 J13.7
  Bottom 0.406: 65.49,4.58 65.5,4.9
  Bottom 0.61: J1.83 65.5,4.9 | 65.5,4.9 v65.5,3 | 65.5,4.9 68,4.9 70,6.9 70,10.35
  Bottom 1.016: 70,10.35 R33.1
84  (via drill 0.3)
  Top 0.61: J1.84 v65.5,11
  GND 0.203: J13.8 73.5,5.04 73.5,7.6 70.1,11 v65.5,11
  Bottom 0.254: 65.54,8.85 J1.84
  Bottom 0.406: 69.69,13 70.04,12.99 R34.1
  Bottom 0.61: J1.84 v65.5,11 | 65.54,8.85 69.69,13
AGND  (via drill 0.25, 0.3, 0.5)
  other vias: 69,2 64.9,7 62.8,7 81.5,15.9 81.5,21 81.1,18.6 81.8,26 80.8,27.8 81.2,30.5 81.9,35 81.6,36.8 81.6,40.5 80.7,47.4 78.9,47.6 75.4,47.9 72.7,47.8 69.2,47.9 66.4,47.7 63.7,47.8 60.7,47.5 58.5,47.8 53.5,47.8 51,47.3 48.4,47.8 44.5,47.8 43.1,47.3 40.5,47.9 39.5,31.5 43,31.6 44.8,31.8 61.7,12.1 60.7,12.9 60,14.1 58.8,14.7 58.2,15.7 56.6,16 55.8,17.1 55.6,18.6 53.7,18.4 53.2,19.8 52.8,21.3 51.3,21.5 51.2,23.2 49.5,23.3 49.1,24.7 47.8,25.3 45.9,25 45.7,26.7 43.9,26.6 42.6,27.1 43.1,29.5 41.1,29.4 49.3,35.4 52,35 54.8,36.8 57.5,37.3 59.9,39.4 62.7,38.8 67,41.2 69.6,41.8 71.7,43 76.2,44.9 66.7,16.9 67.4,18.5 69.5,21.5 69.8,25.2 70.6,27.7 72.8,31.8 74.8,34.5 75.1,37.3 75.1,39.1 64.7,24.3 62.6,23.8 63.8,26.7 61.5,26.3 60.3,27 58.5,27 59.8,30.1 59.2,31.2 55.4,29.2 56.5,32.1 52.6,30 65.2,22.7 70.5,33.5 69.5,34.3 69.7,36.4 67.1,35.5 67.5,37.7 64.7,36.8 62.8,36.6 63.6,15.8 47.4,32 42.2,37.1 40,39.5 59.5,12.3 58.5,12.7 57.5,12.1 56.5,13.2 55.5,12.4 54.5,16.3 54.5,12.1 53.5,12.8 52.5,17 52.5,12.2 51.5,15.7 51.5,11.9 50.5,18.5 50.5,15.4 50.5,12.4 49.5,12.4 48.5,12.7 47.5,11.8 46.5,12.6 45.5,12.3 44.5,11.9 43.5,12.4 42.5,11.8 41.5,11.8 40.5,12.1 39.5,12.6 38.4,11.9 49.5,16.2 48.5,16.6 47.5,16 46.5,16.5 45.5,17.9 44.5,18.6 43.5,18.4 42.5,18.2 41.5,19.5 40.5,19.6 39.5,19.4 48.5,19.6 46.5,21.3 44.5,21.4 43.5,21.4 42.5,22.5 41.5,23.4 40.5,23.6 39.5,23.7 71.8,14.5 73.2,13.2 72.3,11.9 71.2,11.7 73.5,10.8 70.8,9.2 46.5,42 55.5,43 63.5,42 79,42 78,13 82.5,13 36,27 37.5,32 34.5,34 37,39.5 32,41.5 36,47 33,46.5 26.5,46.5
  pour Top: 38.2,0 90,0 90,56 25.2,56 25.2,45.5 33.4,37.3 33.4,26 38.2,21.2
  pour Bottom: 38.2,0 90,0 90,56 25.2,56 25.2,45.5 33.4,37.3 33.4,26 38.2,21.2
  pour SIGNAL: 38.2,0 90,0 90,56 25.2,56 25.2,45.5 33.4,37.3 33.4,26 38.2,21.2
  pour GND: 38.2,0 90,0 90,56 25.2,56 25.2,45.5 33.4,37.3 33.4,26 38.2,21.2
DGND  (via drill 0.25, 0.3, 0.5)
  other vias: 27.2,7 25.1,7 21,2 28.3,12.1 8.3,16 9.2,19.4 8.3,21.7 8.6,23.8 8.4,26.5 9.2,29.7 8.4,31.5 8.9,34.3 8.4,37.5 9,40.2 22.6,16.9 22.8,18.8 21.1,21.3 20.9,24.1 20.1,27.2 19.8,28.9 17.7,31.6 17.7,34.7 17.4,36.7 29.2,13.1 30.4,13.5 30.4,15.4 30.7,16.8 33,16.3 33.7,17.6 35.4,17.5 27.8,19.7 29.4,20.1 25.7,23.6 27.3,24 29.8,23.2 29.3,25.6 23.5,27.7 25.5,27.5 23.5,31.3 35.3,19.6 25.3,20.6 25.3,13.1 25.7,16.4 37.6,12.7 36.5,12.1 35.5,12.8 34.5,12.7 33.5,11.8 32.5,12.5 31.5,12.1 18,14.5 16.8,13.2 18.2,11.9 16.9,10.3 19,9.3 30,30.7 30.5,35.7 27.5,39.7 26.4,35.8 23.5,42.7 23.7,39 16,40.7 11.7,44.8 18.5,48.2 18,44.4 8,12.2 13.5,13.7
  pour Top: 0,56 0,0 37.8,0 37.8,21 33,25.8 33,37 24.8,45.2 24.8,56
  pour Bottom: 0,56 0,0 37.8,0 37.8,21 33,25.8 33,37 24.8,45.2 24.8,56
  pour SIGNAL: 0,56 0,0 37.8,0 37.8,21 33,25.8 33,37 24.8,45.2 24.8,56
  pour GND: 0,56 0,0 37.8,0 37.8,21 33,25.8 33,37 24.8,45.2 24.8,56

### Text on the board
tPlace: VSUP | D3V3 | D1V5 | A1V5 | A3V3 | 30 | 34 | 36 | 40 | 42 | 46 | 48 | 52 | 54 | 58 | DGND | AGND | 29 | 33 | 35 | 39 | 41 | 45 | 47 | 51 | 53 | 57 | 28 | 60 | 27 | 59 | 63 | 64 | 65 | 66 | 69 | 70 | 71 | 72 | 9 | 75 | 10 | 76 | 7 | 1 | 83 | 77 | DGND | AGND | 8 | 2 | 84 | 78
bPlace: Rev | Inspection module | for the Marmote platform | Vanderbilt University, ISIS | Copyright c 2013 | http://marmote.googlecode.com